# EAGLE design usb relay board (EAGLE 6.5.0)
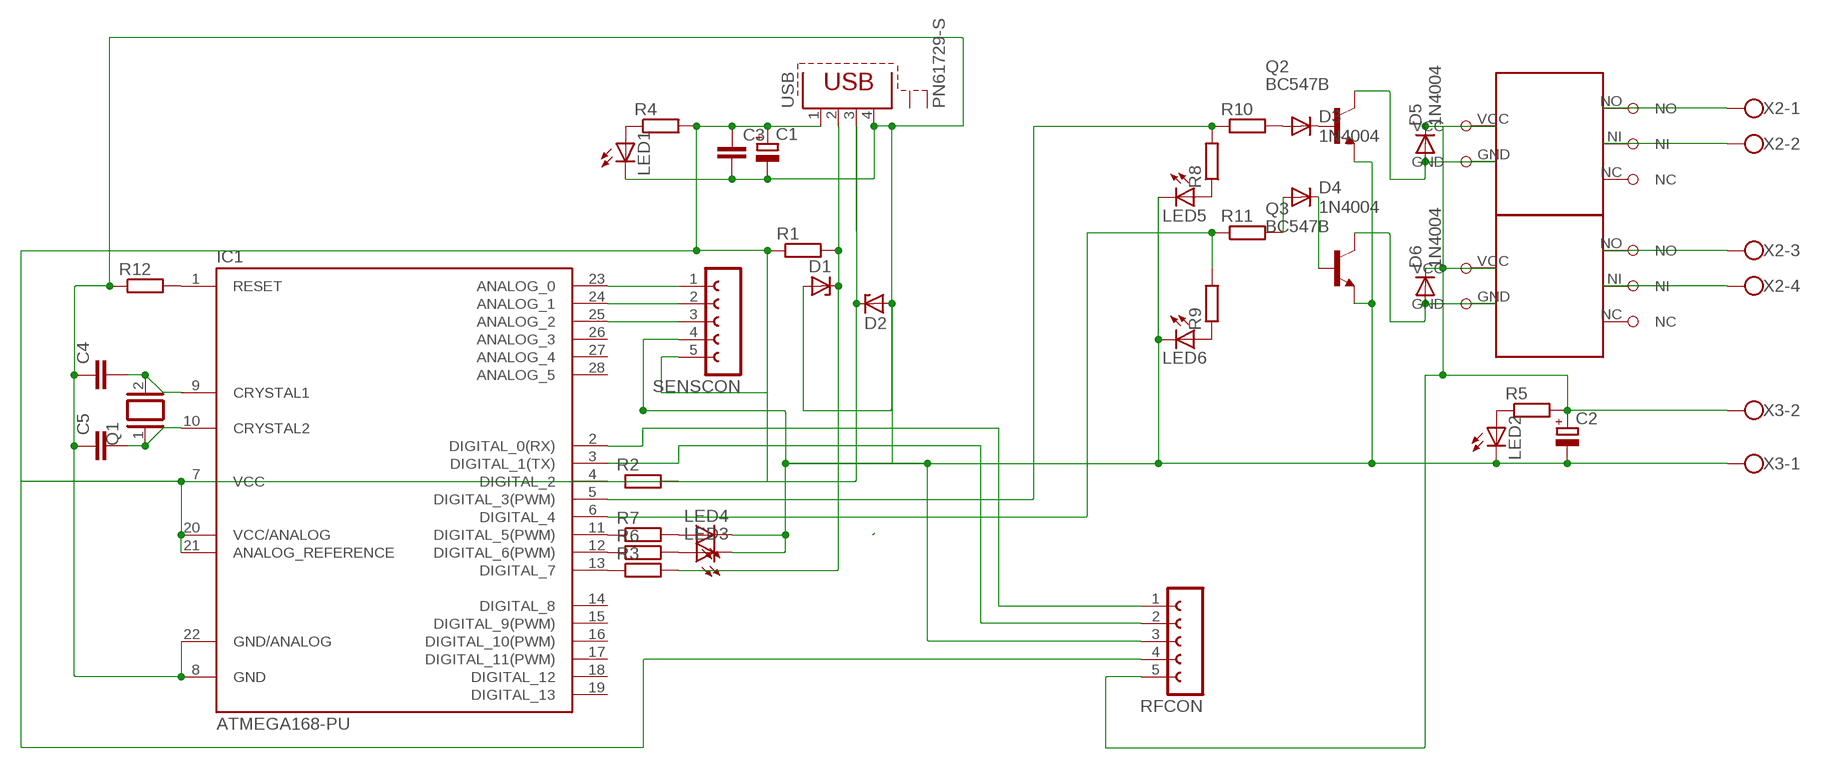
[diagram p0: schematic, sheet 1]

## Parts
C1  CPOL-EUE2.5-7  [E2,5-7]
C2  CPOL-EUE5-10.5  [E5-10,5]
C3  C-EU075-032X103  [C075-032X103]
C4  C-EU075-032X103  [C075-032X103]
C5  C-EU075-032X103  [C075-032X103]
D1  ZENER-DIODEDO34-7  [DO34Z7]
D2  ZENER-DIODEDO34-7  [DO34Z7]
D3  1N4004  [DO41-10]
D4  1N4004  [DO41-10]
D5  1N4004  [DO41-10]
D6  1N4004  [DO41-10]
IC1  ATMEGA168-PU  [DIL28-3]
LED1  LED3MM  [LED3MM]
LED2  LED3MM  [LED3MM]
LED3  LED3MM  [LED3MM]
LED4  LED3MM  [LED3MM]
LED5  LED3MM  [LED3MM]
LED6  LED3MM  [LED3MM]
Q1  XTAL/S  [QS]
Q2  BC547B  [TO92]
Q3  BC547B  [TO92]
R1  R-EU_0204/7  [0204/7]
R2  R-EU_0204/7  [0204/7]
R3  R-EU_0204/7  [0204/7]
R4  R-EU_0204/7  [0204/7]
R5  R-EU_0204/7  [0204/7]
R6  R-EU_0204/7  [0204/7]
R7  R-EU_0204/7  [0204/7]
R8  R-EU_0204/7  [0204/7]
R9  R-EU_0204/7  [0204/7]
R10  R-EU_0204/7  [0204/7]
R11  R-EU_0204/7  [0204/7]
R12  R-EU_0204/7  [0204/7]
RFCON  FE05-1  [FE05-1]
SENSCON  FE05-1  [FE05-1]
U$1  RELAY  [RELAY]
U$2  RELAY  [RELAY]
USB  PN61729-S  [PN61729-S]
X2  W237-4  [W237-4]
X3  W237-102  [W237-102]

## Nets
N$1: U$2.NO X2.3
N$2 [Power DC]: D6.A Q3.3(C) U$2.GND
N$3 [Power DC]: D5.A Q2.3(C) U$1.GND
N$4: U$2.NI X2.4
N$5 [Signal]: C4.2 IC1.9(CRYSTAL1) Q1.2
N$6 [Signal]: C5.2 IC1.10(CRYSTAL2) Q1.1
N$7 [Signal]: C1.- C2.- C3.2 C4.1 C5.1 D1.A D2.A IC1.8(GND) IC1.22(GND/ANALOG) LED1.K(C) LED2.K(C) LED3.K(C) LED4.K(C) LED5.K(C) LED6.K(C) Q2.1(E) Q3.1(E) R12.1 RFCON.3 SENSCON.4 USB.4 X3.1
N$8 [Signal]: IC1.1(RESET) R12.2
N$9 [Signal]: IC1.12(DIGITAL_6(PWM)) R6.1
N$10 [Signal]: IC1.11(DIGITAL_5(PWM)) R7.1
N$11 [Signal]: LED3.A R6.2
N$12 [Signal]: LED4.A R7.2
N$13 [Signal]: IC1.13(DIGITAL_7) R3.1
N$14 [Signal]: IC1.4(DIGITAL_2) R2.1
N$16 [Signal]: LED1.A R4.1
N$19 [Signal]: D1.C R1.2 R3.2 USB.2
N$20 [Signal]: D2.C R2.2 USB.3
N$21 [Signal]: IC1.6(DIGITAL_4) R9.2 R11.1
N$22 [Signal]: C1.+ C3.1 IC1.7(VCC) IC1.20(VCC/ANALOG) IC1.21(ANALOG_REFERENCE) R1.1 R4.2 SENSCON.5 USB.1
N$23 [Signal]: LED2.A R5.1
N$24 [Signal]: D3.C Q2.2(B)
N$25 [Signal]: D4.C Q3.2(B)
N$26 [Signal]: D3.A R10.2
N$27 [Signal]: D4.A R11.2
N$28: U$1.NI X2.2
N$29 [Signal]: IC1.5(DIGITAL_3(PWM)) R8.2 R10.1
N$30 [Signal]: LED5.A R8.1
N$31 [Signal]: LED6.A R9.1
N$33: U$1.NO X2.1
N$34 [Signal]: IC1.23(ANALOG_0) SENSCON.1
N$36 [Power DC]: C2.+ D5.C D6.C R5.2 RFCON.5 U$1.VCC U$2.VCC X3.2
N$37 [Signal]: IC1.24(ANALOG_1) SENSCON.2
N$38 [Signal]: IC1.25(ANALOG_2) SENSCON.3
N$41 [Signal]: IC1.2(DIGITAL_0(RX)) RFCON.1
N$42 [Signal]: IC1.3(DIGITAL_1(TX)) RFCON.2
N$43: RFCON.4
Unconnected: IC1.14(DIGITAL_8) IC1.15(DIGITAL_9(PWM)) IC1.16(DIGITAL_10(PWM)) IC1.17(DIGITAL_11(PWM)) IC1.18(DIGITAL_12) IC1.19(DIGITAL_13) IC1.26(ANALOG_3) IC1.27(ANALOG_4) IC1.28(ANALOG_5) U$1.NC U$2.NC USB.S1 USB.S2

## Library data of the parts
C1 C2 = resistor:CPOL-EU: POLARIZED CAPACITOR, European symbol
C3-C5 = rcl:C-EU: CAPACITOR, European symbol
D1 D2 = diode:ZENER-DIODE: Z-Diode
D3-D6 = diode:1N4004: DIODE general purpose rectifier, 1 A
IC1 = Arduino-AVR:ATMEGA168-PU
LED1-LED6 = led:LED: LED OSRAM: - CHIPLED LG R971, LG N971, LY N971, LG Q971, LY Q971, LO R971, LY R971 LH N974, LH R974 LS Q976, LO Q976, LY Q976 LO Q996 - Hyper CHIPLED LW Q18S LB Q993, LB Q99A, LB R99A - SideLED LS A670, LO A670, LY A670, LG A670, LP A670 LB A673, LV A673, LT A673, LW A673 LH A674 LY A675 LS A676, LA A676, LO A676, LY A676, LW A676 LS A679, LY A679, LG A679 - Hyper Micro SIDELED® LS Y876, LA Y876, LO Y876, LY Y876 LT Y87S - SmartLED LW L88C, LW L88S LB L89C, LB L89S, LG L890 LS L89K, LO L89K, LY L89K LS L896, LA L896, LO L896, LY L896 - TOPLED LS T670, LO T670, LY T670, LG T670, LP T670 LSG T670, LSP T670, LSY T670, LOP T670, LYG T670 LG T671, LOG T671, LSG T671 LB T673, LV T673, LT T673, LW T673 LH T674 LS T676, LA T676, LO T676, LY T676, LB T676, LH T676, LSB T676, LW T676 LB T67C, LV T67C, LT T67C, LS T67K, LO T67K, LY T67K, LW E67C LS E67B, LA E67B, LO E67B, LY E67B, LB E67C, LV E67C, LT E67C LW T67C LS T679, LY T679, LG T679 LS T770, LO T770, LY T770, LG T770, LP T770 LB T773, LV T773, LT T773, LW T773 LH T774 LS E675, LA E675, LY E675, LS T675 LS T776, LA T776, LO T776, LY T776, LB T776 LHGB T686 LT T68C, LB T68C - Hyper Mini TOPLED® LB M676 - Mini TOPLED Santana® LG M470 LS M47K, LO M47K, LY M47K Source: http://www.osram.convergy.de LUXEON: - LUMILED® LXK2-PW12-R00, LXK2-PW12-S00, LXK2-PW14-U00, LXK2-PW14-V00 LXK2-PM12-R00, LXK2-PM12-S00, LXK2-PM14-U00 LXK2-PE12-Q00, LXK2-PE12-R00, LXK2-PE12-S00, LXK2-PE14-T00, LXK2-PE14-U00 LXK2-PB12-K00, LXK2-PB12-L00, LXK2-PB12-M00, LXK2-PB14-N00, LXK2-PB14-P00, LXK2-PB14-Q00 LXK2-PR12-L00, LXK2-PR12-M00, LXK2-PR14-Q00, LXK2-PR14-R00 LXK2-PD12-Q00, LXK2-PD12-R00, LXK2-PD12-S00 LXK2-PH12-R00, LXK2-PH12-S00 LXK2-PL12-P00, LXK2-PL12-Q00, LXK2-PL12-R00 Source: www.luxeon.com KINGBRIGHT: KA-3528ASYC Source: www.kingbright.com
Q1 = special:XTAL/S: CRYSTAL
Q2 Q3 = transistor-npn:BC547*: NPN Transistor
R1-R12 = rcl:R-EU_: RESISTOR, European symbol
RFCON SENSCON = con-lsta:FE05-1: FEMALE HEADER; OC_FARNELL: unknown; OC_NEWARK: unknown
U$1 U$2 = SPDT relay:RELAY
USB = con-berg:PN61729-S: BERG USB connector; OC_FARNELL: unknown; OC_NEWARK: unknown
X2 = con-wago-500:W237-4: WAGO SCREW CLAMP; OC_FARNELL: unknown; OC_NEWARK: unknown
X3 = con-wago-500:W237-102: WAGO SCREW CLAMP; MPN: 237-102; OC_FARNELL: unknown; OC_NEWARK: 70K9898

## Net classes
0 Power AC: width 2 mm
1 Power DC: width 1 mm
2 Signal: width 0.5 mm

## Board
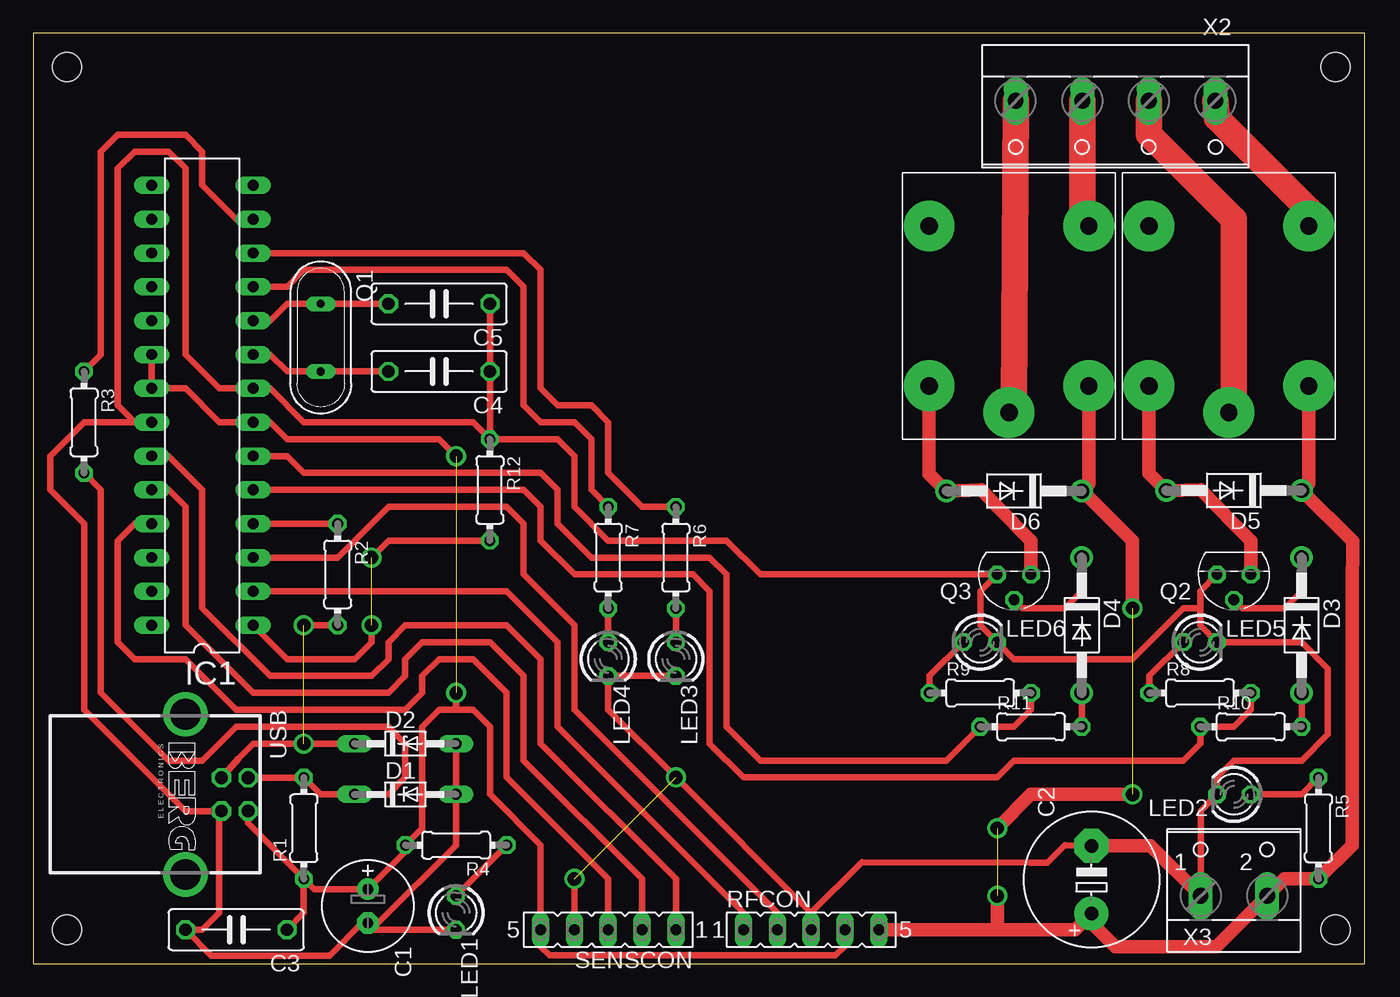
[diagram p1: board, top side]
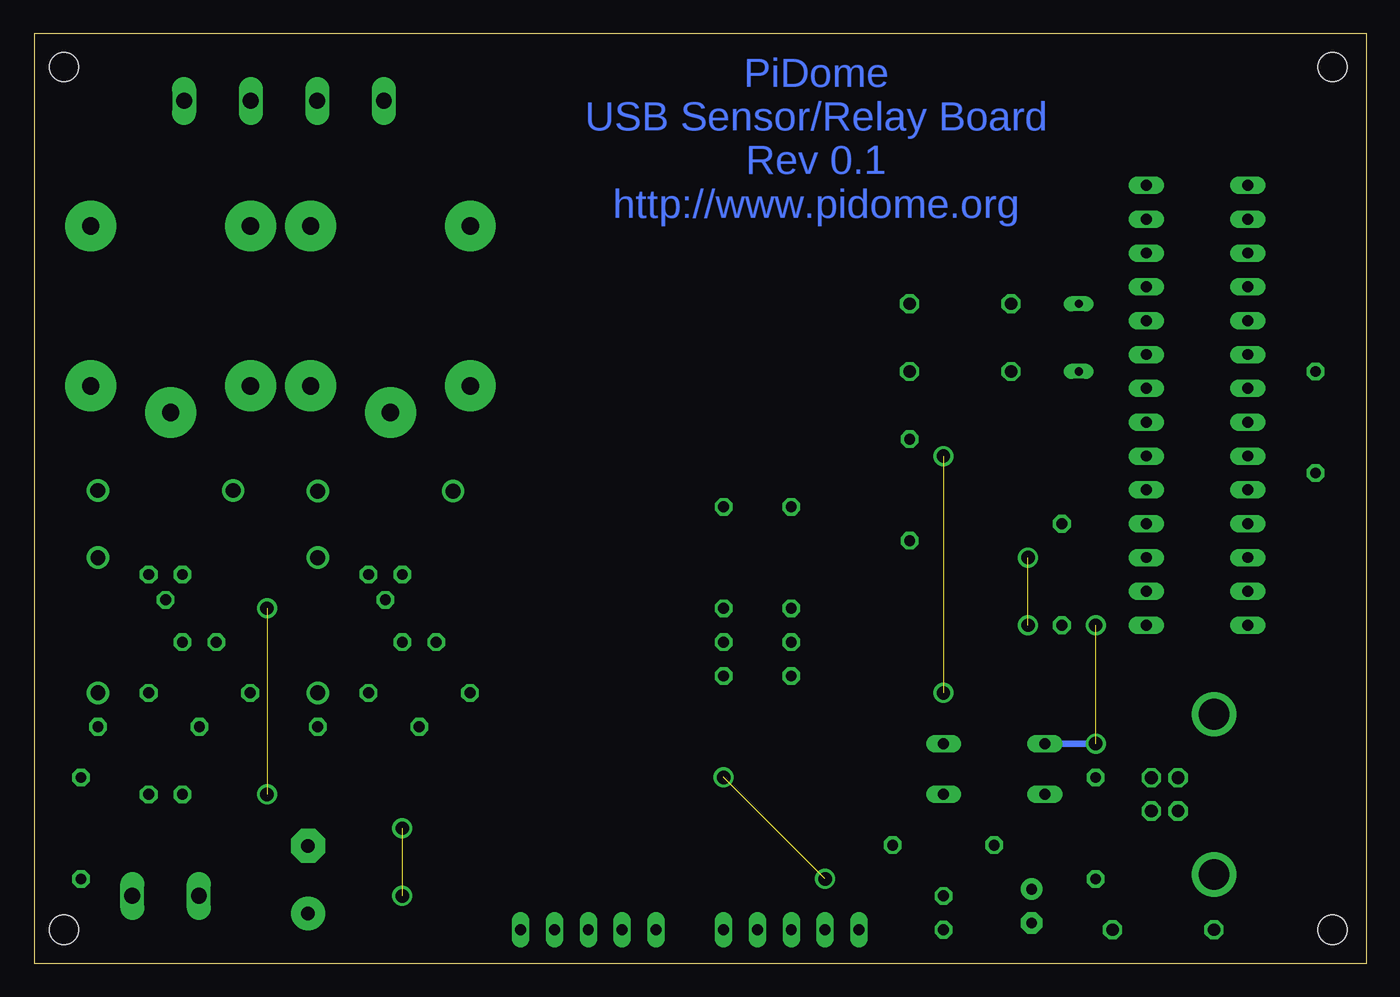
[diagram p2: board, bottom side, seen from below]

Size 100 x 69.84 mm. Coordinates in mm from the lower left corner, seen from the top.
Outline: 0,0 100,0 100,69.84 0,69.84 0,0
Copper layers (1*16): Top 0.035mm / dielectric 1.5mm / Bottom 0.035mm
Design rules "default": minimum track width 10mil, minimum drill 24mil, track to track 8mil, track to pad 8mil, pad to pad 8mil, via to via 8mil, smd to smd 8mil, copper to edge 40mil, drill to drill 8mil, minimum pad ring 10mil, minimum via ring 8mil, stop-mask expansion 4mil, vias tented up to drill 0mil, thermal gap 10mil
Holes 2.2 mm at 97.79,67.31 2.54,67.31 2.54,2.54 97.79,2.54

### Footprints (pad centres in the part's own frame; a part is rotated, then mirrored left to right if it is on the bottom)
E2,5-7 = drill 0.813 pad 1.6: + -1.27,0 | drill 0.813 pad 1.6 octagon: - 1.27,0
E5-10,5 = drill 1.016 pad 2.54: + -2.54,0 | drill 1.016 pad 2.54 octagon: - 2.54,0
C075-032X103 = drill 0.914 octagon: 1 -3.81,0; 2 3.81,0
DO34Z7 = drill 0.813 long: A 3.81,0; C -3.81,0
DO41-10 = drill 1.118: A 5.08,0; C -5.08,0
DIL28-3 = drill 0.813 long: 1 -16.51,-3.81; 2 -13.97,-3.81; 3 -11.43,-3.81; 4 -8.89,-3.81; 5 -6.35,-3.81; 6 -3.81,-3.81; 7 -1.27,-3.81; 8 1.27,-3.81; 9 3.81,-3.81; 10 6.35,-3.81; 11 8.89,-3.81; 12 11.43,-3.81; 13 13.97,-3.81; 14 16.51,-3.81; 15 16.51,3.81; 16 13.97,3.81; 17 11.43,3.81; 18 8.89,3.81; 19 6.35,3.81; 20 3.81,3.81; 21 1.27,3.81; 22 -1.27,3.81; 23 -3.81,3.81; 24 -6.35,3.81; 25 -8.89,3.81; 26 -11.43,3.81; 27 -13.97,3.81; 28 -16.51,3.81
LED3MM = drill 0.813 octagon: A -1.27,0; K 1.27,0
QS = drill 0.61 long: 1 -2.54,0; 2 2.54,0
TO92 = drill 0.813 octagon: 1 1.27,0; 2 0,1.905; 3 -1.27,0
0204/7 = drill 0.813 octagon: 1 -3.81,0; 2 3.81,0
FE05-1 = drill 0.813 long: 1 -5.08,0; 2 -2.54,0; 3 0,0; 4 2.54,0; 5 5.08,0
RELAY = drill 1.3 pad 3.81: GND 4,14; NC 16,14; NI 2,8; NO 16,2; VCC 4,2
PN61729-S = drill 0.95 octagon: 1 1.25,4.71; 2 -1.25,4.71; 3 -1.25,2.71; 4 1.25,2.71 | drill 2.3 pad 2.9: S1 -6.02,0; S2 6.02,0
W237-4 = drill 1.194 long: 1 -7.5,-1.27; 2 -2.5,-1.27; 3 2.5,-1.27; 4 7.5,-1.27
W237-102 = drill 1.194 long: 1 -2.5,-1.27; 2 2.5,-1.27

### Placement (x,y rotation side)
C1  25.12,4.32 270 top
C2  79.47,6.3 90 top
C3  15.24,2.54 180 top
C4  30.48,44.45 180 top
C5  30.48,49.53 180 top
D1  27.94,12.7 0 top
D2  27.94,16.51 0 top
D3  95.25,25.4 270 top
D4  78.74,25.4 270 top
D5  90.17,35.51 180 top
D6  73.66,35.47 180 top
IC1  12.7,41.91 90 top
LED1  31.75,3.81 270 top
LED2  90.17,12.7 180 top
LED3  48.26,22.86 270 top
LED4  43.18,22.86 270 top
LED5  87.63,24.13 0 top
LED6  71.12,24.13 0 top
Q1  21.59,46.99 270 top
Q2  90.17,29.21 180 top
Q3  73.66,29.21 180 top
R1  20.32,10.16 90 top
R2  22.86,29.21 270 top
R3  3.81,40.64 270 top
R4  31.75,8.89 180 top
R5  96.52,10.16 270 top
R6  48.26,30.48 270 top
R7  43.18,30.48 270 top
R8  87.63,20.32 0 top
R9  71.12,20.32 0 top
R10  91.44,17.78 0 top
R11  74.93,17.78 0 top
R12  34.29,35.56 270 top
RFCON  58.42,2.54 0 top
SENSCON  43.18,2.54 180 top
U$1  97.79,39.37 90 top
U$2  81.28,39.37 90 top
USB  11.43,12.7 270 top
X2  81.28,63.5 180 top
X3  90.17,6.35 0 top

### Tracks (layer width: path | path; a pad name or v marks a point on that pad's centre or on a via)
N$1
  Top 2: X2.3 78.78,55.87 U$2.NO
N$2
  Top 1: U$2.GND 67.28,36.77 D6.A 71.21,35.56 72.39,34.29 74.93,31.75 Q3.3
N$3
  Top 1: U$1.GND 83.79,36.82 D5.A 87.68,35.56 90.17,33.02 91.44,31.75 Q2.3
N$4
  Top 2: X2.4 73.66,41.91 U$2.NI
N$5
  Top 0.5: C4.2 Q1.2 19.05,44.45 17.78,45.72 IC1.9
N$6
  Top 0.5: C5.2 Q1.1 19.05,49.53 17.78,48.26 IC1.10
N$7  (via drill 1 pad 0.25, 1 pad 1.02)  (1 unrouted)
  Top 0.5: 58.42,3.81 62.23,7.62 74.88,7.57 76.15,7.57 77.47,8.89 C2.- | LED1.K 25.63,2.54 C1.- | C1.- 25.91,3.05 31.75,8.89 D1.A D2.A | C1.- 24.7,3.05 22.25,0.6 13.37,0.6 C3.2 12.7,2.54 13.97,3.81 13.97,11.28 USB.4 14.12,11.43 11.43,11.43 3.81,19.05 3.81,33.02 1.27,35.56 1.27,38.1 3.81,40.64 7.62,40.64 | 87.63,26.67 87.63,25.4 LED5.K 95.25,24.13 97.24,22.14 97.23,17.22 95.25,15.24 90.17,15.24 88.9,13.97 LED2.K 87.67,11.47 X3.1 | Q2.1 87.63,27.94 87.63,26.67 | 87.63,26.67 86.36,26.67 82.55,22.86 73.66,22.86 LED6.K 71.12,25.4 71.12,27.94 Q3.1 54.61,29.21 52.07,31.75 43.18,31.75 40.64,34.29 40.64,38.1 39.37,39.37 R12.1 | C5.1 C4.1 R12.1 | LED3.K LED4.K 43.18,19.05 v48.26,13.97 58.42,3.81 | 58.42,3.81 RFCON.3 | IC1.22 7.62,40.64 | R12.1 33.02,40.64 20.32,40.64 17.78,43.18 IC1.8 13.97,43.18 11.43,45.72 11.43,59.69 10.16,60.96 7.62,60.96 6.35,59.69 6.35,41.91 7.62,40.64 | SENSCON.4 v40.64,6.35
  Top 1: C2.- 83.91,8.84 X3.1
N$8  (via drill 1)  (1 unrouted)
  Top 0.5: IC1.1 19.05,22.86 24.13,22.86 25.4,24.13 v25.4,25.4 | v25.4,30.48 26.67,31.75 R12.2
N$9
  Top 0.5: R6.1 45.72,34.29 43.18,36.83 43.18,40.64 41.91,41.91 39.37,41.91 38.1,43.18 38.1,52.07 36.83,53.34 IC1.12
N$10
  Top 0.5: R7.1 41.91,35.56 41.91,39.37 40.64,40.64 38.1,40.64 36.83,41.91 36.83,50.8 35.56,52.07 20.32,52.07 19.05,50.8 IC1.11
N$11
  Top 0.5: R6.2 LED3.A
N$12
  Top 0.5: R7.2 LED4.A
N$13
  Top 0.5: IC1.13 15.24,55.88 12.7,58.42 12.7,60.96 11.43,62.23 6.35,62.23 5.08,60.96 5.08,45.72 R3.1
N$14
  Top 0.5: R2.1 IC1.4
N$16
  Top 0.5: LED1.A R4.1
N$19
  Top 0.5: USB.2 20.3,13.95 R1.2 21.59,12.7 D1.C 26.67,12.7 27.94,13.97 27.94,16.51 26.67,17.78 15.24,17.78 12.7,15.24 10.16,15.24 5.08,20.32 5.08,35.56 R3.2
N$20  (via drill 1)  (1 unrouted)
  Top 0.5: D2.C v20.32,16.51 16.51,16.51 15.41,15.41 USB.3 | v20.32,25.4 R2.2
  Bottom 0.5: D2.C v20.32,16.51
N$21
  Top 0.5: R9.2 74.93,19.05 73.66,17.78 R11.1 68.58,15.24 54.61,15.24 52.07,17.78 52.07,29.21 50.8,30.48 41.91,30.48 39.37,33.02 39.37,35.56 38.1,36.83 20.32,36.83 19.05,38.1 IC1.6
N$22  (via drill 1)  (1 unrouted)
  Top 0.5: IC1.20 IC1.21 11.43,43.18 13.97,40.64 IC1.7 17.78,40.64 19.05,39.37 30.48,39.37 v31.75,38.1 | 60.96,2.54 60.96,1.32 60.25,0.61 38.76,0.61 38.1,1.27 SENSCON.5 38.1,8.89 34.29,12.7 34.29,17.78 33.02,19.05 31.75,19.05 | R1.1 21.08,5.59 C1.+ 27.94,8.4 R4.2 29.21,10.16 29.21,17.78 30.48,19.05 31.75,19.05 | R1.1 20.32,3.81 C3.1 | R1.1 16.14,10.53 USB.1 | v31.75,20.32 31.75,19.05
N$23
  Top 0.5: LED2.A 95.25,12.7 R5.1
N$24
  Top 0.5: D3.C 95.25,27.94 93.98,26.67 90.81,26.67 Q2.2
N$25
  Top 0.5: D4.C 78.74,27.94 77.47,26.67 74.3,26.67 Q3.2
N$26
  Top 0.5: D3.A R10.2
N$27
  Top 0.5: R11.2 D4.A
N$28
  Top 2: X2.2 83.78,62.27 90.17,55.88 90.17,41.37 U$1.NI
N$29
  Top 0.5: R8.2 91.44,19.05 90.17,17.78 R10.1 87.63,16.51 86.36,15.24 73.66,15.24 72.39,13.97 53.34,13.97 50.8,16.51 50.8,27.94 49.53,29.21 40.64,29.21 38.1,31.75 38.1,34.29 36.83,35.56 IC1.5
N$30
  Top 0.5: LED5.A 83.82,21.59 R8.1
N$31
  Top 0.5: LED6.A 67.31,21.59 R9.1
N$33
  Top 2: X2.1 88.9,63.5 95.79,56.61 U$1.NO
N$34
  Top 0.5: IC1.23 10.16,38.1 12.7,35.56 12.7,26.67 17.78,21.59 25.4,21.59 26.67,22.86 26.67,24.13 27.94,25.4 35.56,25.4 38.1,22.86 38.1,16.51 48.26,6.35 SENSCON.1
N$36  (via drill 1, 1 pad 1.02)  (2 unrouted)
  Top 1: U$1.VCC 95.79,36.05 D5.C 99.11,31.7 99.06,27.94 99.06,8.89 R5.2 93.94,6.35 X3.2 88.86,1.27 81.28,1.27 79.47,3.08 C2.+ 78.25,2.54 RFCON.5 72.39,2.54 v72.39,5.08 | v82.55,12.7 74.93,12.7 v72.39,10.16 | U$2.VCC 79.28,36.01 D6.C 78.83,35.47 82.55,31.75 v82.55,26.67
N$37
  Top 0.5: IC1.24 10.16,35.56 11.43,34.29 11.43,25.4 16.51,20.32 26.67,20.32 27.94,21.59 27.94,22.86 29.21,24.13 34.29,24.13 36.83,21.59 36.83,15.24 45.72,6.35 SENSCON.2
N$38
  Top 0.5: IC1.25 7.62,33.02 6.35,31.75 6.35,24.13 7.62,22.86 11.43,22.86 15.24,19.05 27.94,19.05 29.21,20.32 29.21,21.59 30.48,22.86 33.02,22.86 35.56,20.32 35.56,13.97 43.18,6.35 SENSCON.3
N$41
  Top 0.5: IC1.2 35.56,27.94 39.37,24.13 39.37,17.78 53.34,3.81 RFCON.1
N$42
  Top 0.5: IC1.3 22.86,30.48 26.67,34.29 35.56,34.29 36.83,33.02 36.83,29.21 40.64,25.4 40.64,19.05 55.88,3.81 RFCON.2

### Text on the board
Bottom: PiDome / USB Sensor/Relay Board / Rev 0.1 / http://www.pidome.org